# Altium schematic sheet Sheet1.SchDoc
size A; SheetNumber: 1; SheetTotal: 1
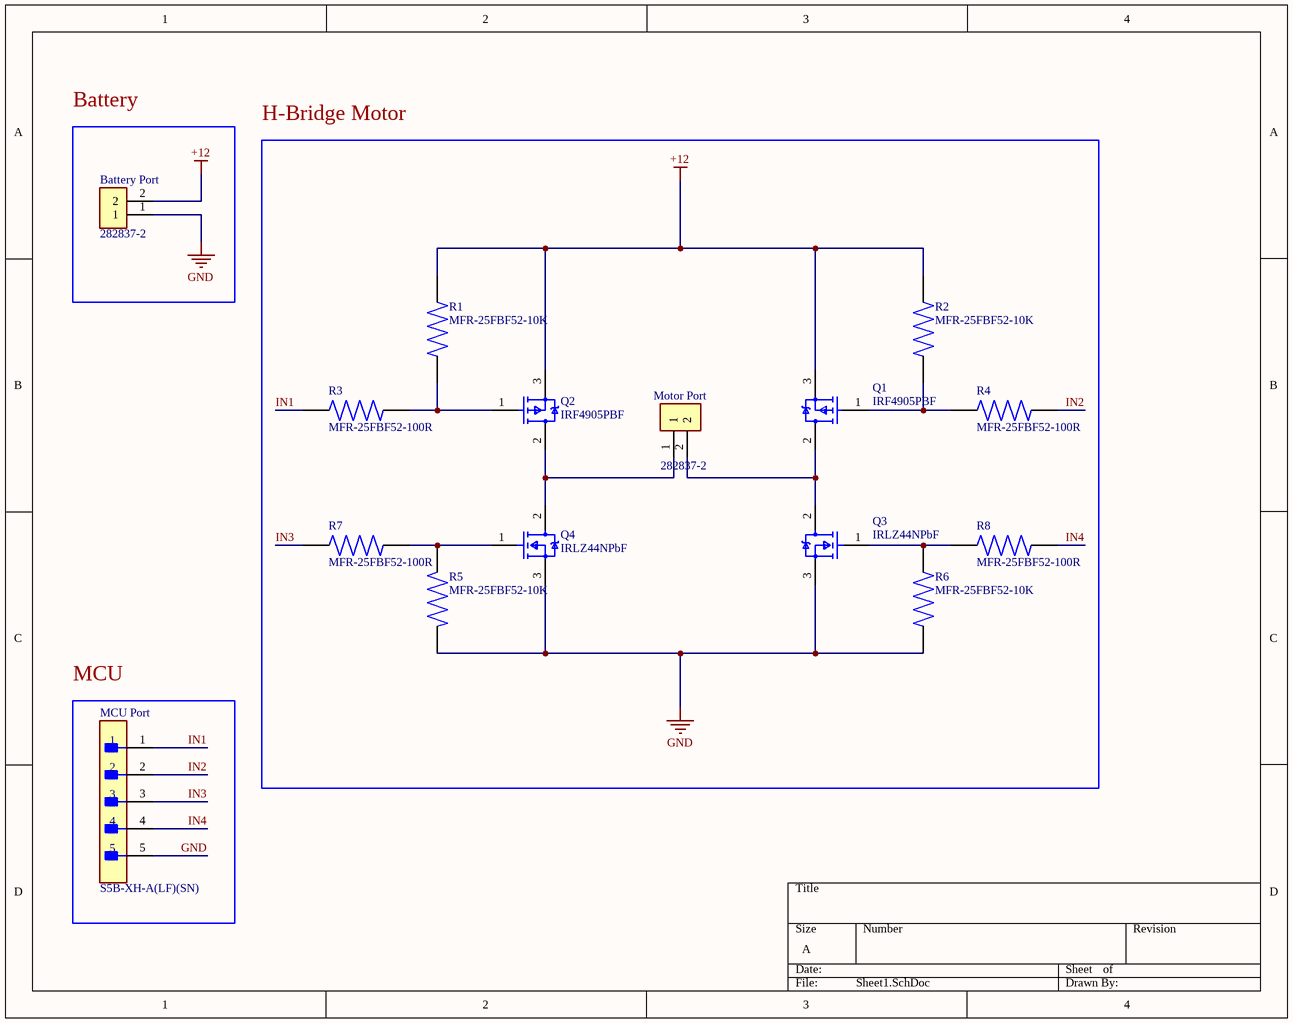
[diagram p0: Sheet1.SchDoc]

## Parts
Battery_Port  282837-2  [TE_282837-2]
MCU_Port  S5B-XH-A(LF)(SN)  [FP-S5B-XH-A_LF_SN-MFG]
Motor_Port  282837-2  [TE_282837-2]
Q1  IRF4905PBF  [FP-PG-TO220-3-MFG]
Q2  IRF4905PBF  [FP-PG-TO220-3-MFG]
Q3  IRLZ44NPbF  [FP-PG-TO220-3-MFG]
Q4  IRLZ44NPbF  [FP-PG-TO220-3-MFG]
R1  MFR-25FBF52-10K  [RESAD1100W55L680D260]
R2  MFR-25FBF52-10K  [RESAD1100W55L680D260]
R3  MFR-25FBF52-100R  [RESAD1100W55L680D260]
R4  MFR-25FBF52-100R  [RESAD1100W55L680D260]
R5  MFR-25FBF52-10K  [RESAD1100W55L680D260]
R6  MFR-25FBF52-10K  [RESAD1100W55L680D260]
R7  MFR-25FBF52-100R  [RESAD1100W55L680D260]
R8  MFR-25FBF52-100R  [RESAD1100W55L680D260]

## Blocks framed on the sheet
Battery: Battery_Port
H-Bridge Motor: Motor_Port Q1-Q4 R1-R8
MCU: MCU_Port

## Nets
+12: Battery_Port.2 Q1.3(SOURCE) Q2.3(SOURCE) R1.2 R2.2
GND: Battery_Port.1 MCU_Port.5 Q3.3(S) Q4.3(S) R5.2 R6.1
IN1: MCU_Port.1 R3.1
IN2: MCU_Port.2 R4.2
IN3: MCU_Port.3 R7.1
IN4: MCU_Port.4 R8.2
NetMotor_Port_1: Motor_Port.1 Q2.2(DRAIN) Q4.2(D)
NetMotor_Port_2: Motor_Port.2 Q1.2(DRAIN) Q3.2(D)
NetQ1_1: Q1.1(GATE) R2.1 R4.1
NetQ2_1: Q2.1(GATE) R1.1 R3.2
NetQ3_1: Q3.1(G) R6.2 R8.1
NetQ4_1: Q4.1(G) R5.1 R7.2

## Library data of the parts
Battery_Port Motor_Port = 282837-2: MF: TE Connectivity; SnapEDA_Link: https://www.snapeda.com/parts/282837-2/TE+Connectivity+AMP+Connectors/view-part/?ref=snap; Price: None; Check_prices: https://www.snapeda.com/parts/282837-2/TE+Connectivity+AMP+Connectors/view-part/?ref=eda; Purchase-URL: https://pricing.snapeda.com/search/part/282837-2/?ref=eda; MP: 282837-2; Value: *; Availability: In Stock; Package: None
MCU_Port = CMP-17439-000302-1: CONN HEADER R/A 5POS 2.5MM; Contact Resistance: 10mR; Voltage Rating: 250V; Number of Contacts: 5; Current Rating: 3A; Insulation Resistance: 1GR; Wire/Cable Gauge: 22AWG; Number of Rows: 1; Contact Plating: Tin; Fastening Type: Detent; Contact Finish - Mating: TIN; Contact Material: Brass; Lead Free: Lead Free; Connector Type: Header; REACH SVHC: No SVHC; Insulation Color: Natural; Orientation: Right Angle; Contact Type: Male Pin; Pitch: 2.5mm; Contact Shape: Square; Series: XH; Color: Natural; Lead Pitch: 2.5mm; Mount: Through Hole; Termination: Solder; Max Operating Temperature: 85°C; Number of Positions: 5; Flammability Rating: UL94 V-0; Min Operating Temperature: -25°C; Packaging: Bulk; Voltage Rating (AC): 250V; Insulation Material: Nylon
Q1 Q2 = CMP-32901-000200-1: MOSFET P-CH 55V 74A TO-220AB; Drain to Source Resistance: 20mR; Input Capacitance: 3.4nF; Max Dual Supply Voltage: -55V; Power Dissipation: 200W; Turn-On Delay Time: 18ns; Element Configuration: Single; Threshold Voltage: -4V; Gate to Source Voltage (Vgs): 20V; Turn-Off Delay Time: 61ns; Number of Pins: 3; Packaging: Rail/Tube; RoHS Compliant: Yes; REACH SVHC: No SVHC; Halogen Free: Halogen Free; Max Power Dissipation: 200W; Drain to Source Breakdown Voltage: -55V; Length: 0.414inch; Drain to Source Voltage (Vdss): -55V; Height: 0.6inch; Case/Package: TO-220; Width: 0.185inch; Continuous Drain Current (ID): 74A; Mount: Through Hole; Min Operating Temperature: -55°C; Lead Free: Lead Free; Max Operating Temperature: 175°C; Rds On Max: 20mR
Q3 Q4 = CMP-32901-000488-1: MOSFET N-CH 55V 47A TO220AB; Turn-On Delay Time: 11ns; Gate to Source Voltage (Vgs): 16V; Element Configuration: Single; Rds On Max: 22mR; Turn-Off Delay Time: 26ns; Max Power Dissipation: 110W; Threshold Voltage: 2V; Drain to Source Resistance: 35mR; Input Capacitance: 1.7nF; Continuous Drain Current (ID): 47A; Case/Package: TO-220; Lead Free: Lead Free; Halogen Free: Halogen Free; Packaging: Rail/Tube; Length: 0.414inch; Min Operating Temperature: -55°C; REACH SVHC: No SVHC; Number of Pins: 3; Width: 0.185inch; Drain to Source Voltage (Vdss): 55V; Power Dissipation: 110W; RoHS Compliant: Yes; Max Operating Temperature: 175°C; Height: 0.6inch; Max Dual Supply Voltage: 55V; Drain to Source Breakdown Voltage: 55V; Mount: Through Hole
R1 R2 R5 R6 = MFR-25FBF52-10K: 10.2 kOhms Â±1% 0.25W, 1/4W Through Hole Resistor Axial - Metal Film; MF: Yageo; SnapEDA_Link: https://www.snapeda.com/parts/MFR-25FBF52-10K/Yageo/view-part/?ref=snap; Availability: In Stock; Price: None; Value: *; Check_prices: https://www.snapeda.com/parts/MFR-25FBF52-10K/Yageo/view-part/?ref=eda; Purchase-URL: https://pricing.snapeda.com/search/part/MFR-25FBF52-10K/?ref=eda; MP: MFR-25FBF52-10K; Package: Axial Yageo
R3 R4 R7 R8 = MFR-25FBF52-10K: 100 Ohms Â±1% 0.25W, 1/4W Through Hole Resistor Axial - Metal Film; MF: Yageo; SnapEDA_Link: https://www.snapeda.com/parts/MFR-25FBF52-10K/Yageo/view-part/?ref=snap; Availability: In Stock; Price: None; Value: *; Check_prices: https://www.snapeda.com/parts/MFR-25FBF52-10K/Yageo/view-part/?ref=eda; Purchase-URL: https://pricing.snapeda.com/search/part/MFR-25FBF52-10K/?ref=eda; MP: MFR-25FBF52-10K; Package: Axial Yageo